# Altium schematic sheet overview.SchDoc: Shepherd - Overview
size 359 x 199 mm; Author: Ingmar; CompanyName: NES Lab / TU Dresden; Organization: NES Lab / TU Dresden; DocumentNumber: 1; SheetNumber: 1; SheetTotal: 8
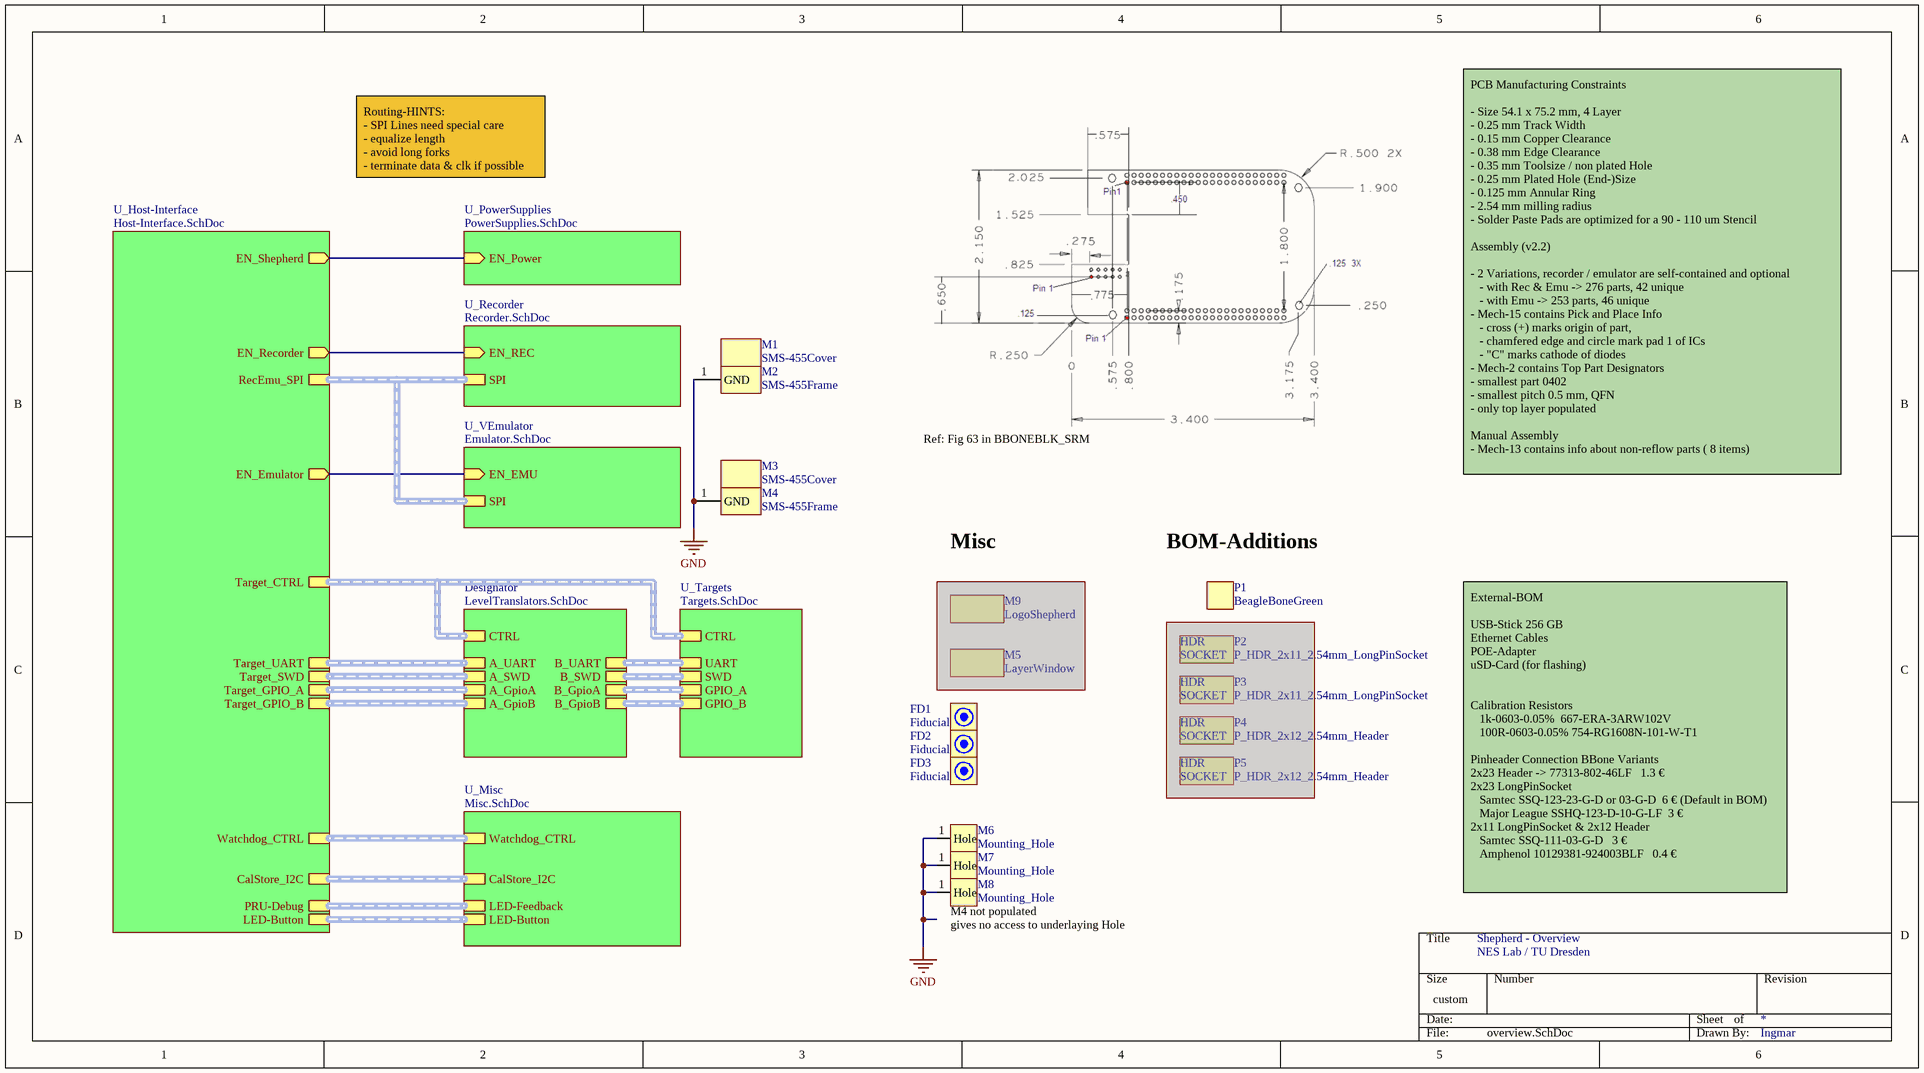
[diagram p0: overview.SchDoc]

## Parts
FD1  Fiducial  [M_Fiducial_3mm]  (no BOM)
FD2  Fiducial  [M_Fiducial_3mm]  (no BOM)
FD3  Fiducial  [M_Fiducial_3mm]  (no BOM)
M1  SMS-455Cover  (mechanical)
M2  SMS-455Frame  [SMS-455F]
M3  SMS-455Cover  (mechanical)
M4  SMS-455Frame  [SMS-455F]
M5  LayerWindow  [LayerWindow_4L_EC_conform_B]  (no BOM)  (masked out: inside a compile mask, not in the netlist)
M6  Mounting_Hole  [M_Mountinghole_3.2mm]  (no BOM)
M7  Mounting_Hole  [M_Mountinghole_3.2mm_min]  (no BOM)
M8  Mounting_Hole  [M_Mountinghole_3.2mm_min]  (no BOM)
M9  LogoShepherd  [LogoShepherd]  (no BOM)  (masked out: inside a compile mask, not in the netlist)
P1  BeagleBoneGreen  (mechanical)
P2  P_HDR_2x11_2.54mm_LongPinSocket  (mechanical)  (masked out: inside a compile mask, not in the netlist)
P3  P_HDR_2x11_2.54mm_LongPinSocket  (mechanical)  (masked out: inside a compile mask, not in the netlist)
P4  P_HDR_2x12_2.54mm_Header  (mechanical)  (masked out: inside a compile mask, not in the netlist)
P5  P_HDR_2x12_2.54mm_Header  (mechanical)  (masked out: inside a compile mask, not in the netlist)

## Sub-sheets
Designator = LevelTranslators.SchDoc: CTRL (harness GPIO), A_GpioA (harness GPIO), B_GpioA (harness GPIO), A_UART (harness UART), A_GpioB (harness GPIO), B_SWD (harness SWD), B_UART (harness UART), B_GpioB (harness GPIO), A_SWD (harness SWD)
U_Host-Interface = Host-Interface.SchDoc: RecEmu_SPI (harness SPI), Target_UART (harness UART), Target_SWD (harness SWD), CalStore_I2C (harness I2C), PRU-Debug (harness GPIO), Watchdog_CTRL (harness Watchdog), EN_Shepherd (out), LED-Button (harness GPIO), Target_CTRL (harness GPIO), Target_GPIO_A (harness GPIO), Target_GPIO_B (harness GPIO), EN_Recorder (out), EN_Emulator (out)
U_Misc = Misc.SchDoc: CalStore_I2C (harness I2C), LED-Feedback (harness GPIO), Watchdog_CTRL (harness Watchdog), LED-Button (harness GPIO)
U_PowerSupplies = PowerSupplies.SchDoc: EN_Power (in)
U_Recorder = Recorder.SchDoc: SPI (harness SPI), EN_REC (in)
U_Targets = Targets.SchDoc: UART (harness UART), SWD (harness SWD), CTRL (harness GPIO), GPIO_A (harness GPIO), GPIO_B (harness GPIO)
U_VEmulator = Emulator.SchDoc: SPI (harness SPI), EN_EMU (in)

## Nets
GND: M2.1(GND) M4.1(GND) M6.1(Hole) M7.1(Hole) M8.1(Hole)
(unnamed): sheet U_Host-Interface/EN_Shepherd, sheet U_PowerSupplies/EN_Power
(unnamed): sheet U_Host-Interface/EN_Recorder, sheet U_Recorder/EN_REC
(unnamed): sheet U_Host-Interface/EN_Emulator, sheet U_VEmulator/EN_EMU

## Buses and harness runs
harness sheet Designator/A_GpioA = sheet U_Host-Interface/Target_GPIO_A
harness sheet Designator/A_GpioB = sheet U_Host-Interface/Target_GPIO_B
harness sheet Designator/A_SWD = sheet U_Host-Interface/Target_SWD
harness sheet Designator/A_UART = sheet U_Host-Interface/Target_UART
harness sheet Designator/B_GpioA = sheet U_Targets/GPIO_A
harness sheet Designator/B_GpioB = sheet U_Targets/GPIO_B
harness sheet Designator/B_SWD = sheet U_Targets/SWD
harness sheet Designator/B_UART = sheet U_Targets/UART
harness sheet Designator/CTRL = sheet U_Host-Interface/Target_CTRL = sheet U_Targets/CTRL
harness sheet U_Host-Interface/CalStore_I2C = sheet U_Misc/CalStore_I2C
harness sheet U_Host-Interface/LED-Button = sheet U_Misc/LED-Button
harness sheet U_Host-Interface/PRU-Debug = sheet U_Misc/LED-Feedback
harness sheet U_Host-Interface/RecEmu_SPI = sheet U_Recorder/SPI = sheet U_VEmulator/SPI
harness sheet U_Host-Interface/Watchdog_CTRL = sheet U_Misc/Watchdog_CTRL

## Notes on the sheet
- Routing-HINTS:
  - SPI Lines need special care
  - equalize length
  - avoid long forks
  - terminate data & clk if possible
- Ref: Fig 63 in BBONEBLK_SRM
- PCB Manufacturing Constraints
  - Size 54.1 x 75.2 mm, 4 Layer
  - 0.25 mm Track Width
  - 0.15 mm Copper Clearance
  - 0.38 mm Edge Clearance
  - 0.35 mm Toolsize / non plated Hole
  - 0.25 mm Plated Hole (End-)Size
  - 0.125 mm Annular Ring
  - 2.54 mm milling radius
  - Solder Paste Pads are optimized for a 90 - 110 um Stencil
  Assembly (v2.2)
  - 2 Variations, recorder / emulator are self-contained and optional
  - with Rec & Emu -> 276 parts, 42 unique
  - with Emu -> 253 parts, 46 unique
  - Mech-15 contains Pick and Place Info
  - cross (+) marks origin of part,
  - chamfered edge and circle mark pad 1 of ICs
  - "C" marks cathode of diodes
  - Mech-2 contains Top Part Designators
  - smallest part 0402
  - smallest pitch 0.5 mm, QFN
  - only top layer populated
  Manual Assembly
  - Mech-13 contains info about non-reflow parts ( 8 items)
- Misc
- BOM-Additions
- External-BOM
  USB-Stick 256 GB
  Ethernet Cables
  POE-Adapter
  uSD-Card (for flashing)
  Calibration Resistors
  1k-0603-0.05% 	667-ERA-3ARW102V
  100R-0603-0.05%	754-RG1608N-101-W-T1
  Pinheader Connection BBone Variants
  2x23 Header -> 77313-802-46LF   1.3 €
  2x23 LongPinSocket
  Samtec SSQ-123-23-G-D or 03-G-D  6 € (Default in BOM)
  Major League SSHQ-123-D-10-G-LF  3 €
  2x11 LongPinSocket & 2x12 Header
  Samtec SSQ-111-03-G-D   3 €
  Amphenol 10129381-924003BLF   0.4 €
- (near M8) gives no access to underlaying Hole
- (near M8) M4 not populated
- (in symbol .P_HDR_2x11_2.54mm_LongPinSocket) HDR; SOCKET
- (in symbol .P_HDR_2x12_2.54mm_Header) HDR; SOCKET

## Library data of the parts
M1 M3 = SMS-455Cover: EMI-Shield Cover, SMT, .75"x.75", 18x18mm, Height 5.08 mm, ~40-70 dB; Manufacturer: LeaderTech; Manufacturer PN: SMS-455-N-C; Distributer: Mouser; Distributer PN: 861-SMS-455-N-C; Price n10 [€]: 0.34
M2 M4 = SMS-455Frame: EMI-Shield Frame, SMT, .75"x.75", 18x18mm, Height 5.08 mm, ~40-70 dB; Manufacturer: LeaderTech; Manufacturer PN: SMS-455-N-F; Distributer: Mouser; Distributer PN: 861-SMS-455-N-F; Price n10 [€]: 1.87
P1 = BeagleBoneGreen: Manufacturer: Seeed Studio; Manufacturer PN: 102010027; Distributer: RS-Online; Distributer PN: 174-3279; Price n10 [€]: 39.19
P2 P3 = .P_HDR_2x11_2.54mm_LongPinSocket: 10 mm Tail length; Manufacturer: Samtec; Manufacturer PN: SSQ-111-03-G-D; I_max: 6.3; Distributer: Mouser; Distributer PN: 200-SSQ11103GD; Price n10 [€]: 2.82
P4 P5 = .P_HDR_2x12_2.54mm_Header: Manufacturer: Amphenol FCI; Manufacturer PN: 10129381-924003BLF; I_max: 3A; V_max: 110V; Distributer: Mouser; Distributer PN: 649-1012938192403BLF; Price n10 [€]: 0.39